# EAGLE schematic untitled (EAGLE 9.6.2)
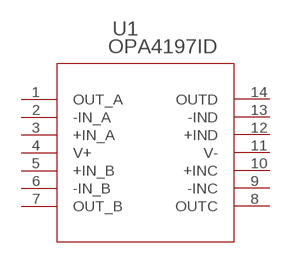
[diagram p0: schematic, sheet 1]

## Parts
U1  OPA4197ID  [D14_TEX]
Unconnected: U1.1(OUT_A) U1.2(-IN_A) U1.3(+IN_A) U1.5(+IN_B) U1.6(-IN_B) U1.7(OUT_B) U1.8(OUTC) U1.9(-INC) U1.10(+INC) U1.12(+IND) U1.13(-IND) U1.14(OUTD)

## Power pins joined to a net without a drawn wire
V+: U1.4(V+)
V-: U1.11(V-)

## Library data of the parts
U1 = op_amp:OPA4197ID; BUILT_BY: EMA_Molly; COPYRIGHT: Copyright (C) 2018 Accelerated Designs. All rights reserved; MANUFACTURER_PART_NUMBER: OPA4197ID; SOURCELIBRARY: TI_2019-05-11; VENDOR: Texas Instruments